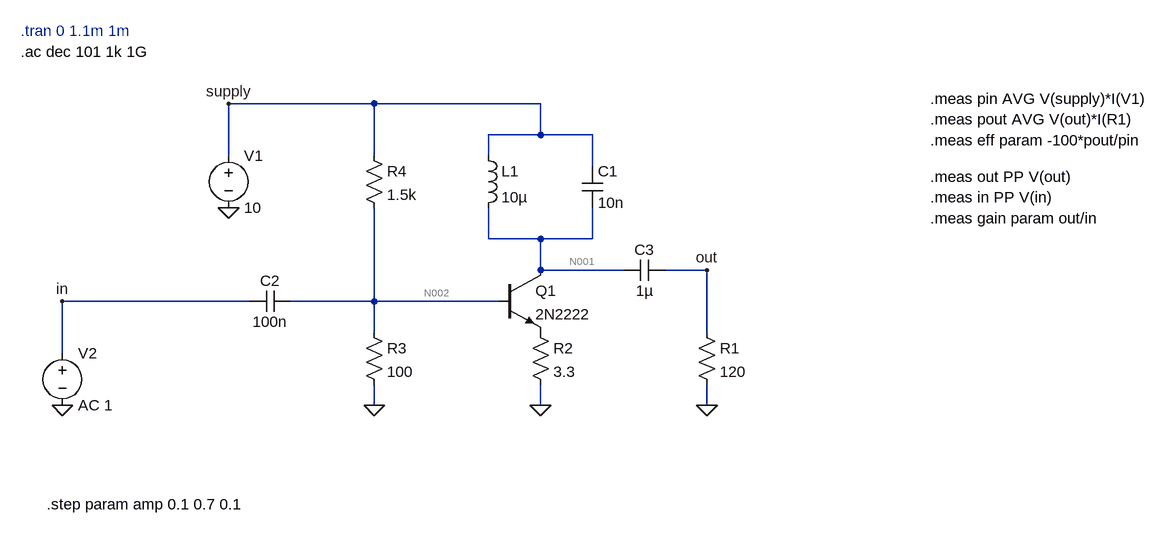
[diagram p0: schematic class-B-2n2222-500kHz.asc]
class-B-2n2222-500kHz.asc, the LTspice schematic file:
Version 4
SHEET 1 1168 680
WIRE -64 -432 -288 -432
WIRE 192 -432 -64 -432
WIRE 192 -384 192 -432
WIRE 192 -384 112 -384
WIRE 272 -384 192 -384
WIRE -288 -352 -288 -432
WIRE -64 -352 -64 -432
WIRE 112 -352 112 -384
WIRE 272 -336 272 -384
WIRE 112 -224 112 -272
WIRE 192 -224 112 -224
WIRE 272 -224 272 -272
WIRE 272 -224 192 -224
WIRE 192 -176 192 -224
WIRE 320 -176 192 -176
WIRE 448 -176 384 -176
WIRE -256 -128 -544 -128
WIRE -64 -128 -64 -272
WIRE -64 -128 -192 -128
WIRE 128 -128 -64 -128
WIRE -64 -80 -64 -128
WIRE 448 -80 448 -176
WIRE -544 -48 -544 -128
WIRE -64 32 -64 0
WIRE 192 32 192 0
WIRE 448 32 448 0
FLAG -544 32 0
FLAG -64 32 0
FLAG 192 32 0
FLAG 448 32 0
FLAG -288 -272 0
FLAG -544 -128 in
FLAG 448 -176 out
FLAG -288 -432 supply
SYMBOL voltage -544 -64 R0
WINDOW 123 0 0 Left 0
WINDOW 39 0 0 Left 0
SYMATTR InstName V2
SYMATTR Value AC 1
SYMBOL voltage -288 -368 R0
WINDOW 123 0 0 Left 0
WINDOW 39 0 0 Left 0
SYMATTR InstName V1
SYMATTR Value 10
SYMBOL res 432 -96 R0
SYMATTR InstName R1
SYMATTR Value 120
SYMBOL res 176 -96 R0
SYMATTR InstName R2
SYMATTR Value 3.3
SYMBOL res -80 -96 R0
SYMATTR InstName R3
SYMATTR Value 100
SYMBOL res -80 -368 R0
SYMATTR InstName R4
SYMATTR Value 1.5k
SYMBOL ind 96 -368 R0
SYMATTR InstName L1
SYMATTR Value 10µ
SYMBOL cap 256 -336 R0
SYMATTR InstName C1
SYMATTR Value 10n
SYMBOL cap -192 -144 R90
WINDOW 0 0 32 VBottom 2
WINDOW 3 32 32 VTop 2
SYMATTR InstName C2
SYMATTR Value 100n
SYMBOL cap 384 -192 R90
WINDOW 0 0 32 VBottom 2
WINDOW 3 32 32 VTop 2
SYMATTR InstName C3
SYMATTR Value 1µ
SYMBOL npn 128 -176 R0
SYMATTR InstName Q1
SYMATTR Value 2N2222
TEXT -608 -544 Left 2 ;.tran 0 1.1m 1m
TEXT 792 -440 Left 2 !.meas pin AVG V(supply)*I(V1)
TEXT 792 -408 Left 2 !.meas pout AVG V(out)*I(R1)
TEXT 792 -376 Left 2 !.meas eff param -100*pout/pin
TEXT 792 -320 Left 2 !.meas out PP V(out)
TEXT 792 -288 Left 2 !.meas in PP V(in)
TEXT 792 -256 Left 2 !.meas gain param out/in
TEXT -568 184 Left 2 !.step param amp 0.1 0.7 0.1
TEXT -608 -512 Left 2 !.ac dec 101 1k 1G

The netlist it stands for:
* class-B-2n2222-500kHz.asc
V2 in 0 AC 1
V1 supply 0 10
R1 out 0 120
R2 P001 0 3.3
R3 N002 0 100
R4 supply N002 1.5k
L1 supply N001 10µ
C1 supply N001 10n
C2 N002 in 100n
C3 out N001 1µ
Q1 N001 N002 P001 0 2N2222
.model NPN NPN
.model PNP PNP
.lib standard.bjt
* .tran 0 1.1m 1m
.meas pin AVG V(supply)*I(V1)
.meas pout AVG V(out)*I(R1)
.meas eff param -100*pout/pin
.meas out PP V(out)
.meas in PP V(in)
.meas gain param out/in
.step param amp 0.1 0.7 0.1
.ac dec 101 1k 1G
.backanno
.end

* Results of the author's LTspice run, read from the files saved beside the schematic
* Operating Point (first step), zero values left out:
*   amp = 100 m
*   V(supply) = 10 V
*   V(p001) = 1.075 mV
*   V(n002) = 624.9 mV
*   V(n001) = 10 V
*   Ic(Q1) = 324.4 µA
*   Ib(Q1) = 1.484 µA
*   Ie(Q1) = -325.8 µA
*   I(L1) = 324.4 µA
*   I(R2) = 325.8 µA
*   I(R3) = 6.249 mA
*   I(R4) = 6.25 mA
*   I(V1) = -6.574 mA
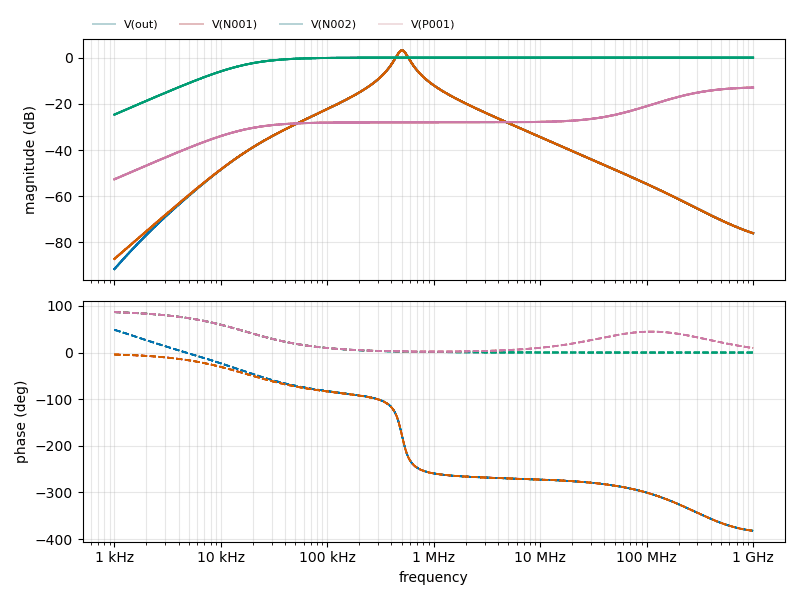
[diagram p1: AC Analysis of class-B-2n2222-500kHz.asc, plotted from the saved traces]
* AC Analysis, 7 runs:
*   V(out) [amp=0.1]: -91.52 dB at 1 kHz, -76.02 dB at 1 GHz, peak 3.14 dB at 504.6 kHz, 3 dB below the peak at 441 kHz and 573.8 kHz
*   V(out) [amp=0.2]: -91.52 dB at 1 kHz, -76.02 dB at 1 GHz, peak 3.14 dB at 504.6 kHz, 3 dB below the peak at 441 kHz and 573.8 kHz
*   V(out) [amp=0.3]: -91.52 dB at 1 kHz, -76.02 dB at 1 GHz, peak 3.14 dB at 504.6 kHz, 3 dB below the peak at 441 kHz and 573.8 kHz
*   V(out) [amp=0.4]: -91.52 dB at 1 kHz, -76.02 dB at 1 GHz, peak 3.14 dB at 504.6 kHz, 3 dB below the peak at 441 kHz and 573.8 kHz
*   V(out) [amp=0.5]: -91.52 dB at 1 kHz, -76.02 dB at 1 GHz, peak 3.14 dB at 504.6 kHz, 3 dB below the peak at 441 kHz and 573.8 kHz
*   V(out) [amp=0.6]: -91.52 dB at 1 kHz, -76.02 dB at 1 GHz, peak 3.14 dB at 504.6 kHz, 3 dB below the peak at 441 kHz and 573.8 kHz
*   V(out) [amp=0.7]: -91.52 dB at 1 kHz, -76.02 dB at 1 GHz, peak 3.14 dB at 504.6 kHz, 3 dB below the peak at 441 kHz and 573.8 kHz
*   V(N001) [amp=0.1]: -87.11 dB at 1 kHz, -76.02 dB at 1 GHz, peak 3.14 dB at 504.6 kHz, 3 dB below the peak at 441 kHz and 573.8 kHz
*   V(N001) [amp=0.2]: -87.11 dB at 1 kHz, -76.02 dB at 1 GHz, peak 3.14 dB at 504.6 kHz, 3 dB below the peak at 441 kHz and 573.8 kHz
*   V(N001) [amp=0.3]: -87.11 dB at 1 kHz, -76.02 dB at 1 GHz, peak 3.14 dB at 504.6 kHz, 3 dB below the peak at 441 kHz and 573.8 kHz
*   V(N001) [amp=0.4]: -87.11 dB at 1 kHz, -76.02 dB at 1 GHz, peak 3.14 dB at 504.6 kHz, 3 dB below the peak at 441 kHz and 573.8 kHz
*   V(N001) [amp=0.5]: -87.11 dB at 1 kHz, -76.02 dB at 1 GHz, peak 3.14 dB at 504.6 kHz, 3 dB below the peak at 441 kHz and 573.8 kHz
*   V(N001) [amp=0.6]: -87.11 dB at 1 kHz, -76.02 dB at 1 GHz, peak 3.14 dB at 504.6 kHz, 3 dB below the peak at 441 kHz and 573.8 kHz
*   V(N001) [amp=0.7]: -87.11 dB at 1 kHz, -76.02 dB at 1 GHz, peak 3.14 dB at 504.6 kHz, 3 dB below the peak at 441 kHz and 573.8 kHz
*   V(N002) [amp=0.1]: -24.66 dB at 1 kHz, -0.00 dB at 1 GHz, peak -0.00 dB at 1 GHz, 3 dB below the peak at 17.07 kHz
*   V(N002) [amp=0.2]: -24.66 dB at 1 kHz, -0.00 dB at 1 GHz, peak -0.00 dB at 1 GHz, 3 dB below the peak at 17.07 kHz
*   V(N002) [amp=0.3]: -24.66 dB at 1 kHz, -0.00 dB at 1 GHz, peak -0.00 dB at 1 GHz, 3 dB below the peak at 17.07 kHz
*   V(N002) [amp=0.4]: -24.66 dB at 1 kHz, -0.00 dB at 1 GHz, peak -0.00 dB at 1 GHz, 3 dB below the peak at 17.07 kHz
*   V(N002) [amp=0.5]: -24.66 dB at 1 kHz, -0.00 dB at 1 GHz, peak -0.00 dB at 1 GHz, 3 dB below the peak at 17.07 kHz
*   V(N002) [amp=0.6]: -24.66 dB at 1 kHz, -0.00 dB at 1 GHz, peak -0.00 dB at 1 GHz, 3 dB below the peak at 17.07 kHz
*   V(N002) [amp=0.7]: -24.66 dB at 1 kHz, -0.00 dB at 1 GHz, peak -0.00 dB at 1 GHz, 3 dB below the peak at 17.07 kHz
*   V(P001) [amp=0.1]: -52.67 dB at 1 kHz, -12.94 dB at 1 GHz, peak -12.94 dB at 1 GHz, 3 dB below the peak at 245.6 MHz
*   V(P001) [amp=0.2]: -52.67 dB at 1 kHz, -12.94 dB at 1 GHz, peak -12.94 dB at 1 GHz, 3 dB below the peak at 245.6 MHz
*   V(P001) [amp=0.3]: -52.67 dB at 1 kHz, -12.94 dB at 1 GHz, peak -12.94 dB at 1 GHz, 3 dB below the peak at 245.6 MHz
*   V(P001) [amp=0.4]: -52.67 dB at 1 kHz, -12.94 dB at 1 GHz, peak -12.94 dB at 1 GHz, 3 dB below the peak at 245.6 MHz
*   V(P001) [amp=0.5]: -52.67 dB at 1 kHz, -12.94 dB at 1 GHz, peak -12.94 dB at 1 GHz, 3 dB below the peak at 245.6 MHz
*   V(P001) [amp=0.6]: -52.67 dB at 1 kHz, -12.94 dB at 1 GHz, peak -12.94 dB at 1 GHz, 3 dB below the peak at 245.6 MHz
*   V(P001) [amp=0.7]: -52.67 dB at 1 kHz, -12.94 dB at 1 GHz, peak -12.94 dB at 1 GHz, 3 dB below the peak at 245.6 MHz
* From the log:
*   Measurement: pin
*     step  AVG(v(supply)*i(v1))  FROM  TO
*        1  0  1000  1e+09
*        2  0  1000  1e+09
*        3  0  1000  1e+09
*        4  0  1000  1e+09
*        5  0  1000  1e+09
*        6  0  1000  1e+09
*        7  0  1000  1e+09
*   Measurement: pout
*     step  AVG(v(out)*i(r1))  FROM  TO
*        1  3.56945e-06  1000  1e+09
*        2  3.56945e-06  1000  1e+09
*        3  3.56945e-06  1000  1e+09
*        4  3.56945e-06  1000  1e+09
*        5  3.56945e-06  1000  1e+09
*        6  3.56945e-06  1000  1e+09
*        7  3.56945e-06  1000  1e+09
*   Measurement: eff
*     step  -100*pout/pin
*        1  (-nan(ind)dB,-nan(ind)°)
*        2  (-nan(ind)dB,-nan(ind)°)
*        3  (-nan(ind)dB,-nan(ind)°)
*        4  (-nan(ind)dB,-nan(ind)°)
*        5  (-nan(ind)dB,-nan(ind)°)
*        6  (-nan(ind)dB,-nan(ind)°)
*        7  (-nan(ind)dB,-nan(ind)°)
*   Measurement: out
*     step  PP(v(out))  FROM  TO
*        1  (94.665dB,131.837°)  1000  1e+09
*        2  (94.665dB,131.837°)  1000  1e+09
*        3  (94.665dB,131.837°)  1000  1e+09
*        4  (94.665dB,131.837°)  1000  1e+09
*        5  (94.665dB,131.837°)  1000  1e+09
*        6  (94.665dB,131.837°)  1000  1e+09
*        7  (94.665dB,131.837°)  1000  1e+09
*   Measurement: in
*     step  PP(v(in))  FROM  TO
*        1  (0dB,0°)  1000  1e+09
*        2  (0dB,0°)  1000  1e+09
*        3  (0dB,0°)  1000  1e+09
*        4  (0dB,0°)  1000  1e+09
*        5  (0dB,0°)  1000  1e+09
*        6  (0dB,0°)  1000  1e+09
*        7  (0dB,0°)  1000  1e+09
*   Measurement: gain
*     step  out/in
*        1  (94.665dB,131.837°)
*        2  (94.665dB,131.837°)
*        3  (94.665dB,131.837°)
*        4  (94.665dB,131.837°)
*        5  (94.665dB,131.837°)
*        6  (94.665dB,131.837°)
*        7  (94.665dB,131.837°)